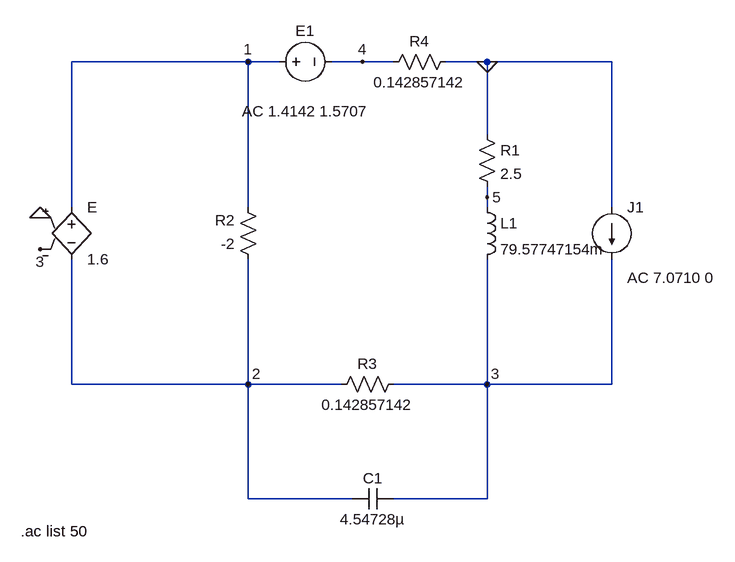
[diagram p0: schematic Curent Alternativ.asc]
Curent Alternativ.asc, the LTspice schematic file:
Version 4
SHEET 1 880 852
WIRE 32 112 -240 112
WIRE 80 112 32 112
WIRE 208 112 160 112
WIRE 256 112 208 112
WIRE 400 112 336 112
WIRE 592 112 400 112
WIRE 400 224 400 112
WIRE 400 320 400 304
WIRE -240 336 -240 112
WIRE 32 336 32 112
WIRE 400 336 400 320
WIRE 592 336 592 112
WIRE -240 608 -240 416
WIRE 32 608 32 416
WIRE 32 608 -240 608
WIRE 176 608 32 608
WIRE 400 608 400 416
WIRE 400 608 256 608
WIRE 592 608 592 416
WIRE 592 608 400 608
WIRE 32 784 32 608
WIRE 192 784 32 784
WIRE 400 784 400 608
WIRE 400 784 256 784
FLAG 400 112 0
FLAG 32 112 1
FLAG 400 608 3
FLAG 32 608 2
FLAG 208 112 4
FLAG -288 400 3
FLAG -288 352 0
FLAG 400 320 5
SYMBOL voltage 64 112 R270
WINDOW 0 32 56 VTop 2
WINDOW 3 -32 56 VBottom 2
WINDOW 123 -60 56 VBottom 2
WINDOW 39 0 0 Left 0
SYMATTR InstName E1
SYMATTR Value ""
SYMATTR Value2 AC 1.4142 1.5707
SYMBOL current 592 336 R0
WINDOW 123 24 108 Left 2
WINDOW 39 0 0 Left 0
SYMATTR InstName J1
SYMATTR Value ""
SYMATTR Value2 AC 7.0710 0
SYMBOL res 48 432 R180
WINDOW 0 36 76 Left 2
WINDOW 3 36 40 Left 2
SYMATTR InstName R2
SYMATTR Value -2
SYMBOL res 384 208 R0
SYMATTR InstName R1
SYMATTR Value 2.5
SYMBOL res 272 592 R90
WINDOW 0 0 56 VBottom 2
WINDOW 3 32 56 VTop 2
SYMATTR InstName R3
SYMATTR Value 0.142857142
SYMBOL res 240 128 R270
WINDOW 0 32 56 VTop 2
WINDOW 3 0 56 VBottom 2
SYMATTR InstName R4
SYMATTR Value 0.142857142
SYMBOL e -240 320 R0
SYMATTR InstName E
SYMATTR Value 1.6
SYMBOL ind 384 320 R0
SYMATTR InstName L1
SYMATTR Value 79.57747154m
SYMBOL cap 192 800 R270
WINDOW 0 32 32 VTop 2
WINDOW 3 0 32 VBottom 2
SYMATTR InstName C1
SYMATTR Value 4.54728µ
TEXT -318 834 Left 2 !.ac list 50

The netlist it stands for:
* Curent Alternativ.asc
V§E1 1 4 AC 1.4142 1.5707
I§J1 0 3 AC 7.0710 0
R2 2 1 -2
R1 0 5 2.5
R3 3 2 0.142857142
R4 4 0 0.142857142
E 1 2 0 3 1.6
L1 5 3 79.57747154m
C1 2 3 4.54728µ
.ac list 50
.backanno
.end